# Altium schematic sheet Latching.SchDoc
size A3
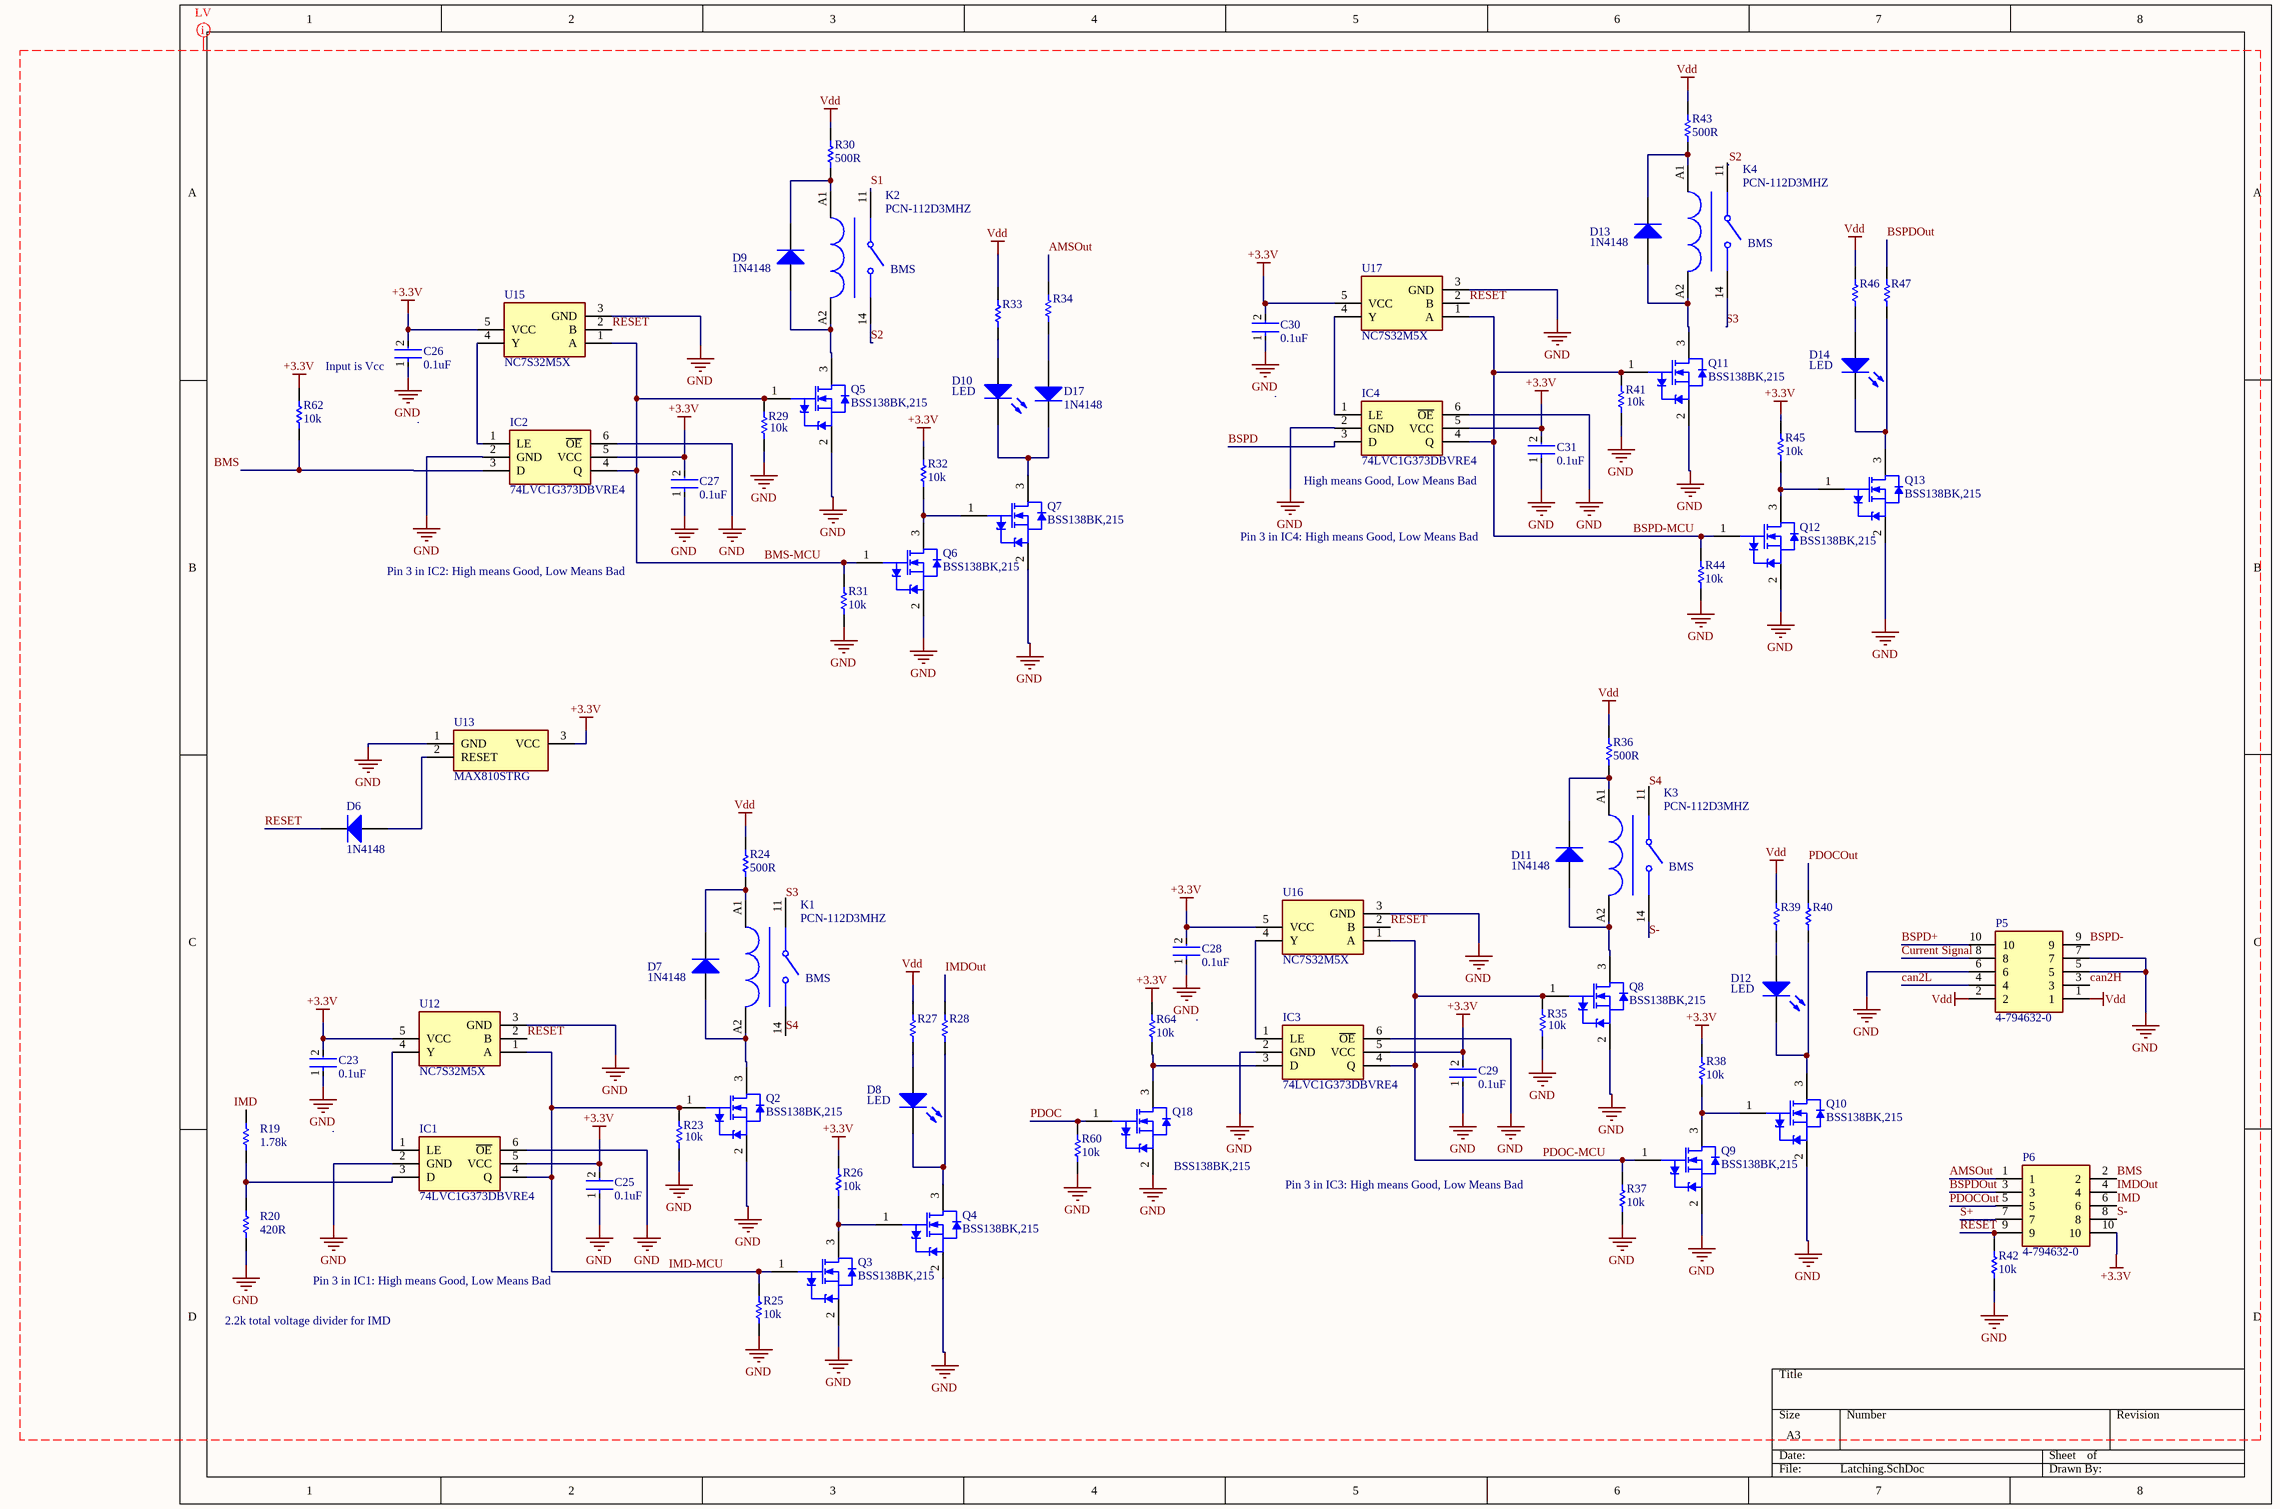
[diagram p0: Latching.SchDoc]

## Parts
C23  0.1uF  [FP-C0603-CJ-MFG]
C25  0.1uF  [FP-C0603-CJ-MFG]
C26  0.1uF  [FP-C0603-CJ-MFG]
C27  0.1uF  [FP-C0603-CJ-MFG]
C28  0.1uF  [FP-C0603-CJ-MFG]
C29  0.1uF  [FP-C0603-CJ-MFG]
C30  0.1uF  [FP-C0603-CJ-MFG]
C31  0.1uF  [FP-C0603-CJ-MFG]
D6  1N4148  [DIOD-SOD123-2_V]
D7  1N4148  [DIOD-SOD123-2_V]
D8  LED  [1206_A]
D9  1N4148  [DIOD-SOD123-2_V]
D10  LED  [1206_A]
D11  1N4148  [DIOD-SOD123-2_V]
D12  LED  [1206_A]
D13  1N4148  [DIOD-SOD123-2_V]
D14  LED  [1206_A]
D17  1N4148  [DIOD-SOD123-2_V]
IC1  74LVC1G373DBVRE4  [SOT95P280X145-6N]
IC2  74LVC1G373DBVRE4  [SOT95P280X145-6N]
IC3  74LVC1G373DBVRE4  [SOT95P280X145-6N]
IC4  74LVC1G373DBVRE4  [SOT95P280X145-6N]
K1  PCN-112D3MHZ  [PCN-112D3MHZ]
K2  PCN-112D3MHZ  [PCN-112D3MHZ]
K3  PCN-112D3MHZ  [PCN-112D3MHZ]
K4  PCN-112D3MHZ  [PCN-112D3MHZ]
P5  4-794632-0  [SHDR10W82P300_2X5_1586X686X944P]
P6  4-794632-0  [SHDR10W82P300_2X5_1586X686X944P]
Q2  BSS138BK,215  [NXP-SOT23_N]
Q3  BSS138BK,215  [NXP-SOT23_N]
Q4  BSS138BK,215  [NXP-SOT23_N]
Q5  BSS138BK,215  [NXP-SOT23_N]
Q6  BSS138BK,215  [NXP-SOT23_N]
Q7  BSS138BK,215  [NXP-SOT23_N]
Q8  BSS138BK,215  [NXP-SOT23_N]
Q9  BSS138BK,215  [NXP-SOT23_N]
Q10  BSS138BK,215  [NXP-SOT23_N]
Q11  BSS138BK,215  [NXP-SOT23_N]
Q12  BSS138BK,215  [NXP-SOT23_N]
Q13  BSS138BK,215  [NXP-SOT23_N]
Q18  BSS138BK,215  [NXP-SOT23_N]
R19  value 1.78k  [RESC1608X55N]  (hidden comment: Res1)
R20  value 420R  [RESC1608X55N]  (hidden comment: Res1)
R23  10k  [RESC1608X55N]
R24  500R  [RESC1608X55N]
R25  10k  [RESC1608X55N]
R26  10k  [RESC1608X55N]
R27  CRCW2512649RFKEG  [Resistor__E2512]  (value not drawn)
R28  CRCW2512649RFKEG  [Resistor__E2512]  (value not drawn)
R29  10k  [RESC1608X55N]
R30  500R  [RESC1608X55N]
R31  10k  [RESC1608X55N]
R32  10k  [RESC1608X55N]
R33  CRCW2512649RFKEG  [Resistor__E2512]  (value not drawn)
R34  CRCW2512649RFKEG  [Resistor__E2512]  (value not drawn)
R35  10k  [RESC1608X55N]
R36  500R  [RESC1608X55N]
R37  10k  [RESC1608X55N]
R38  10k  [RESC1608X55N]
R39  CRCW2512649RFKEG  [Resistor__E2512]  (value not drawn)
R40  CRCW2512649RFKEG  [Resistor__E2512]  (value not drawn)
R41  10k  [RESC1608X55N]
R42  10k  [RESC1608X55N]
R43  500R  [RESC1608X55N]
R44  10k  [RESC1608X55N]
R45  10k  [RESC1608X55N]
R46  CRCW2512649RFKEG  [Resistor__E2512]  (value not drawn)
R47  CRCW2512649RFKEG  [Resistor__E2512]  (value not drawn)
R60  10k  [RESC1608X55N]
R62  10k  [RESC1608X55N]
R64  10k  [RESC1608X55N]
U12  NC7S32M5X  [SOT95P275X110-5N]
U13  MAX810STRG  [SOT96P237X111-3N]
U15  NC7S32M5X  [SOT95P275X110-5N]
U16  NC7S32M5X  [SOT95P275X110-5N]
U17  NC7S32M5X  [SOT95P275X110-5N]

## Nets
+3.3V: C23.2 C25.2 C26.2 C27.2 C28.2 C29.2 C30.2 C31.2 IC1.5(VCC) IC2.5(VCC) IC3.5(VCC) IC4.5(VCC) P6.10 R26.2 R32.2 R38.2 R45.2 R62.2 R64.2 U12.5(VCC) U13.3(VCC) U15.5(VCC) U16.5(VCC) U17.5(VCC)
GND: C23.1 C25.1 C26.1 C27.1 C28.1 C29.1 C30.1 C31.1 IC1.2(GND) IC1.6(~{OE}) IC2.2(GND) IC2.6(~{OE}) IC3.2(GND) IC3.6(~{OE}) IC4.2(GND) IC4.6(~{OE}) P5.5 P5.6 P5.7 Q2.2(S) Q3.2(S) Q4.2(S) Q5.2(S) Q6.2(S) Q7.2(S) Q8.2(S) Q9.2(S) Q10.2(S) Q11.2(S) Q12.2(S) Q13.2(S) Q18.2(S) R20.1 R23.1 R25.1 R29.1 R31.1 R35.1 R37.1 R41.1 R42.1 R44.1 R60.1 U12.3(GND) U13.1(GND) U15.3(GND) U16.3(GND) U17.3(GND)
Vdd: P5.1 P5.2 R24.2 R27.2 R30.2 R33.2 R36.2 R39.2 R43.2 R46.2
AMSOut: P6.1 R34.2
BMS: IC2.3(D) P6.2 R62.1
BMS-MCU: IC2.4(Q) Q5.1(G) Q6.1(G) R29.2 R31.2 U15.1(A)
BSPD: IC4.3(D)
BSPD+: P5.10
BSPD-: P5.9
BSPD-MCU: IC4.4(Q) Q11.1(G) Q12.1(G) R41.2 R44.2 U17.1(A)
BSPDOut: P6.3 R47.2
can2H: P5.3
can2L: P5.4
Current Signal: P5.8
IMD: P6.6 R19.2
IMD-MCU: IC1.4(Q) Q2.1(G) Q3.1(G) R23.2 R25.2 U12.1(A)
IMDOut: P6.4 R28.2
PDOC: Q18.1(G) R60.2
PDOC-MCU: IC3.4(Q) Q8.1(G) Q9.1(G) R35.2 R37.2 U16.1(A)
PDOCOut: P6.5 R40.2
RESET: D6.2(K) P6.9 R42.2 U12.2(B) U15.2(B) U16.2(B) U17.2(B)
S1: K2.11
S2: K2.14 K4.11
S3: K1.11 K4.14
S4: K1.14 K3.11
S+: P6.7
S-: K3.14 P6.8
NetD6_1: D6.1(A) U13.2(RESET)
NetD7_1: D7.1(A) K1.A2 Q2.3(D)
NetD7_2: D7.2(K) K1.A1 R24.1
NetD8_1: D8.1(K) Q4.3(D) R28.1
NetD8_2: D8.2(A) R27.1
NetD9_1: D9.1(A) K2.A2 Q5.3(D)
NetD9_2: D9.2(K) K2.A1 R30.1
NetD10_1: D10.1(K) D17.2(K) Q7.3(D)
NetD10_2: D10.2(A) R33.1
NetD11_1: D11.1(A) K3.A2 Q8.3(D)
NetD11_2: D11.2(K) K3.A1 R36.1
NetD12_1: D12.1(K) Q10.3(D) R40.1
NetD12_2: D12.2(A) R39.1
NetD13_1: D13.1(A) K4.A2 Q11.3(D)
NetD13_2: D13.2(K) K4.A1 R43.1
NetD14_1: D14.1(K) Q13.3(D) R47.1
NetD14_2: D14.2(A) R46.1
NetD17_1: D17.1(A) R34.1
NetIC1_1: IC1.1(LE) U12.4(Y)
NetIC1_3: IC1.3(D) R19.1 R20.2
NetIC2_1: IC2.1(LE) U15.4(Y)
NetIC3_1: IC3.1(LE) U16.4(Y)
NetIC3_3: IC3.3(D) Q18.3(D) R64.1
NetIC4_1: IC4.1(LE) U17.4(Y)
NetQ3_3: Q3.3(D) Q4.1(G) R26.1
NetQ6_3: Q6.3(D) Q7.1(G) R32.1
NetQ9_3: Q9.3(D) Q10.1(G) R38.1
NetQ12_3: Q12.3(D) Q13.1(G) R45.1

## Layout directives
net class LV: +3.3V, AMSOut, BMS, BMS-MCU, BSPD, BSPD+, BSPD-, BSPD-MCU, BSPDOut, can2H, can2L, Current Signal, GND, IMD, IMD-MCU, IMDOut, PDOC, PDOC-MCU, PDOCOut, RESET, S1, S2, S3, S4, S+, S-, Vdd

## Notes on the sheet
- (near K4) BMS
- (near K2) BMS
- (near C26) Input is Vcc
- (near IC4) High means Good, Low Means Bad
- Pin 3 in IC2: High means Good, Low Means Bad
- Pin 3 in IC4: High means Good, Low Means Bad
- (near K3) BMS
- (near K1) BMS
- Pin 3 in IC3: High means Good, Low Means Bad
- 2.2k total voltage divider for IMD
- Pin 3 in IC1: High means Good, Low Means Bad

## Library data of the parts
C23 C25-C31 = CMP-2006-03300-2: CAP CER 0.1UF 50V X7R 0603; Manufacturer Part Number: C0603X104K5RACTU; Manufacturer: Kemet; Capacitance: 100nF; Material: Ceramic; Tolerance: 10%; Value: 100nF; Temperature Coefficient: 15%; Temperature Range High: +125°C; Temperature Range Low: -55°C; Voltage: 50V; ComponentLink2Description: Datasheet; RoHS: TRUE; ComponentLink2URL: https://content.kemet.com/datasheets/KEM_C1013_X7R_FT-CAP_SMD.pdf; Device Class L3: Ceramic Capacitors; Device Class L2: Capacitors; Package: C0603-CJ; Height: 0.95mm; Device Class L1: Passive Components; Temperature Characteristic: X7R; Lead Free: Yes; Digikey Description: CAP CER 0.1UF 50V X7R 0603; Automotive: No; Mouser Description: Capacitor; Ceramic; Cap 0.1uF; Tol+10%; SMT; Flexible Termination; Vol-Rtg 50V; TR; Temperature: -55°C to +125°C; Octopart: https://octopart.com/c0603x104k5ractu-kemet-9145062; Category: Cap; Voltage Rating: 50V; Ipc Land Pattern Name: CAPC16080X80
D6 D7 D9 D11 D13 D17 = 1N4148W-7-F: DIODE GEN PURP 100V 300MA SOD123; Manufacturer 1: Diodes; Forward Current: 150mA; Element Configuration: Single; Reverse Recovery Time: 4ns; Max Forward Surge Current (Ifsm): 2A; Polarity: Standard; Voltage Rating (DC): 75V; Power Rating: 400mW; Capacitance: 2pF; Peak Reverse Current: 1uA; Forward Voltage: 1.25V; Supplier 1: Digi-Key; Supplier Part Number 1: 1N4148W-FDIDKR-ND; Manufacturer Part Number 1: 1N4148W-7-F; Stock 1: 3523690; Pricing 1: 1=0.16000, 10=0.14600, 25=0.13880, 100=0.06110, 250=0.05868, 500=0.04800, 1000=0.03333 (USD); RoHS: Yes; Mount: Surface Mount; Number of Pins: 2; Weight: 0.000353oz; Contact Plating: Tin,Matte; Min Operating Temperature: -65°C; Max Operating Temperature: 150°C; Voltage: 100V; Packaging: Tape and Reel; Max Repetitive Reverse Voltage (Vrrm): 100V; Peak Non-Repetitive Surge Current: 2A; Current Rating: 150mA; Output Current: 150mA; Max Surge Current: 2A; Package Quantity: 3000; Recovery Time: 4ns; Max Reverse Voltage (DC): 100V; Average Rectified Current: 300mA; Power Dissipation: 400mW; Length: 2.85mm; Height: 1.25mm; Width: 1.7mm; Radiation Hardening: No; REACH SVHC: No SVHC; Lead Free: Lead Free; ComponentLink1URL: https://datasheet.ciiva.com/911/ds30086-911734.pdf?src-supplier=Digi-Key; ComponentLink1Description: https://datasheet.ciiva.com/911/ds30086-911734.pdf?src-supplier=Digi-Key; ComponentLink2URL: https://datasheet.ciiva.com/911/ds30086-911735.pdf?src-supplier=Digi-Key; ComponentLink2Description: https://datasheet.ciiva.com/911/ds30086-911735.pdf?src-supplier=Digi-Key; ComponentLink3URL: https://datasheet.ciiva.com/911/ds30086-911736.pdf?src-supplier=Digi-Key; ComponentLink3Description: https://datasheet.ciiva.com/911/ds30086-911736.pdf?src-supplier=Digi-Key; ComponentLink4URL: https://datasheet.ciiva.com/8300/ds30086-8300392.pdf?src-supplier=Avnet; ComponentLink4Description: https://datasheet.ciiva.com/8300/ds30086-8300392.pdf?src-supplier=Avnet; ComponentLink5URL: https://datasheet.ciiva.com/25919/ds30086-25919609.pdf?src-supplier=Avnet+Europe; ComponentLink5Description: https://datasheet.ciiva.com/25919/ds30086-25919609.pdf?src-supplier=Avnet+Europe; ComponentLink6URL: https://datasheet.ciiva.com/22695/1915529-22695239.pdf?src-supplier=Element14; ComponentLink6Description: https://datasheet.ciiva.com/22695/1915529-22695239.pdf?src-supplier=Element14; ComponentLink7URL: https://datasheet.ciiva.com/1179/1915529-1179304.pdf?src-supplier=Element14; ComponentLink7Description: https://datasheet.ciiva.com/1179/1915529-1179304.pdf?src-supplier=Element14; ComponentLink8URL: https://datasheet.ciiva.com/4435/ds30086-4435128.pdf?src-supplier=Mouser; ComponentLink8Description: https://datasheet.ciiva.com/4435/ds30086-4435128.pdf?src-supplier=Mouser; ComponentLink9URL: https://datasheet.ciiva.com/15219/getdatasheetpartid-110030-15219548.pdf?src-supplier=Verical; ComponentLink9Description: https://datasheet.ciiva.com/15219/getdatasheetpartid-110030-15219548.pdf?src-supplier=Verical; ComponentLink10URL: https://datasheet.ciiva.com/8303/ds30086-8303197.pdf?src-supplier=Avnet; ComponentLink10Description: https://datasheet.ciiva.com/8303/ds30086-8303197.pdf?src-supplier=Avnet
D8 D10 D12 D14 = 150120SS75000: WURTH ELEKTRONIK   150120SS75000   LED, 1206, SUP. RED, 60MCD, 630NM; Manufacturer 1: Wurth Electronics; Test Current: 20mA; Viewing Angle: 140°; Lens Style: Clear,Rectangular; Forward Current: 30mA; Forward Voltage: 1.9V; Supplier 1: Digi-Key; Supplier Part Number 1: 732-4992-1-ND; Manufacturer Part Number 1: 150120SS75000; Stock 1: 2344; Pricing 1: 1=0.21000, 50=0.19800, 100=0.17100, 500=0.14800 (USD); RoHS: Yes; Mount: Surface Mount; Case/Package: 1206; Color: Red; Case Code (Metric): 3216; Case Code (Imperial): 1206; Min Operating Temperature: -40°C; Max Operating Temperature: 85°C; Dominant Wavelength: 630nm; Package Quantity: 3000; Packaging: Tape and Reel; Luminous Intensity: 60mcd; Wavelength: 630nm; Length: 3.2mm; Height: 0.68mm; Width: 1.6mm; REACH SVHC: Unknown; ComponentLink1URL: https://datasheet.ciiva.com/29561/150120ss75000-29561862.pdf?src-supplier=Digi-Key; ComponentLink1Description: https://datasheet.ciiva.com/29561/150120ss75000-29561862.pdf?src-supplier=Digi-Key; ComponentLink2URL: https://datasheet.ciiva.com/29279/759443-da-01-en-chipled-1206-w-kl-s-rot-150120ss75000-29279053.pdf?src-supplier=Conrad; ComponentLink2Description: https://datasheet.ciiva.com/29279/759443-da-01-en-chipled-1206-w-kl-s-rot-150120ss75000-29279053.pdf?src-supplier=Conrad; ComponentLink3URL: https://datasheet.ciiva.com/29561/150120ss75000-29561863.pdf?src-supplier=Digi-Key; ComponentLink3Description: https://datasheet.ciiva.com/29561/150120ss75000-29561863.pdf?src-supplier=Digi-Key; ComponentLink4URL: https://datasheet.ciiva.com/48430/150120ss75000-eng-tds-48430055.pdf?src-supplier=Distrelec; ComponentLink4Description: https://datasheet.ciiva.com/48430/150120ss75000-eng-tds-48430055.pdf?src-supplier=Distrelec; ComponentLink5URL: https://datasheet.ciiva.com/29561/150120ss75000-29561864.pdf?src-supplier=Digi-Key; ComponentLink5Description: https://datasheet.ciiva.com/29561/150120ss75000-29561864.pdf?src-supplier=Digi-Key
IC1-IC4 = 74LVC1G373DBVRE4: Integrated Circuit; Manufacturer_Name: Texas Instruments; Datasheet Link: http://www.ti.com/general/docs/suppproductinfo.tsp?distId=10&gotoUrl=http%3A%2F%2Fwww.ti.com%2Flit%2Fgpn%2Fsn74lvc1g373; Height: 1.45mm; Manufacturer_Part_Number: 74LVC1G373DBVRE4
K1-K4 = PCN-112D3MHZ: Relay
P5 P6 = 4-794632-0: Connector; Manufacturer_Name: TE Connectivity; Datasheet Link: https://www.mouser.com/ProductDetail/TE-Connectivity-AMP/4-794632-0?qs=Rd%252BN518myCyGOpGRvqIhCg%3D%3D; Height: 9.44mm; Manufacturer_Part_Number: 4-794632-0; Mouser Part Number: 571-4-794632-0; Mouser Price/Stock: https://www.mouser.co.uk/ProductDetail/TE-Connectivity-AMP/4-794632-0?qs=Rd%252BN518myCyGOpGRvqIhCg%3D%3D
Q2-Q13 Q18 = CMP-1259-00087-1: N-Channel Trench MOSFET, 60 V, 0.36 A, -55 to 150 degC, 3-Pin SOT23, Tape and Reel; Manufacturer: NXP Semiconductors; Channel Type: N; IDM [max] (A): 1.2; VDS [max] (V): 60; Packing: Tape & Reel; ID [max] (A): 0.36; Automotive Qualified: Y; VGSth [typ] (V): 1.1; PackageReference: SOT23; Code_JEDEC: TO-236AB; PackageDescription: 3-Pin Small Outline Transistor Package, Body 2.9 x 1.3 mm, Pitch 0.95 mm; ComponentLink2URL: http://www.nxp.com/documents/data_sheet/BSS138BK.pdf; PartNumber: BSS138BK,215; DatasheetVersion: Rev. 1; ComponentLink3Description: Package Specification; ComponentLink3URL: http://www.nxp.com/documents/outline_drawing/sot023_po.pdf; Mounting Technology: Surface Mount; ComponentLink1URL: http://www.nxp.com/; ComponentLink1Description: Manufacturer URL; ComponentLink2Description: Datasheet; PackageVersion: 06-03-16, 03/2006
R19 R20 = Res1: 679-0260; Published: 8-Jun-2000; LatestRevisionDate: 17-Jul-2002; LatestRevisionNote: Re-released for DXP Platform.; PackageReference: AXIAL-0.3; Publisher: Altium Limited; PackageDescription: Axial Device, Thru-Hole; 2 Leads; 0.3 in Pin Spacing
R23-R26 R29-R32 R35-R38 R41-R45 R60 R62 R64 = RC0805JR-0710KL: 10k E0805 1% 1/8W; Tolerance: 5%; Resistance: 10kR; Power Rating: 125mW; Temperature Coefficient: 100ppm/°C; Voltage Rating: 150V; MPN: *; Category: *; RoHS: Yes; Case/Package: 0805; Contact Plating: Tin; Case Code (Imperial): 0805; Case Code (Metric): 2012; Min Operating Temperature: -55°C; Max Operating Temperature: 155°C; Composition: Thick Film; Packaging: Tape and Reel; Termination: SMD/SMT; Military Standard: Not; Length: 2mm; Height: 0.5mm; Width: 1.25mm; Depth: 1.25mm; Radiation Hardening: No; REACH SVHC: Unknown; Lead Free: Lead Free; ComponentLink1URL: https://datasheet.ciiva.com/7941/444164-7941870.pdf?src-supplier=Element14; ComponentLink1Description: https://datasheet.ciiva.com/7941/444164-7941870.pdf?src-supplier=Element14; ComponentLink2URL: https://datasheet.ciiva.com/7941/444164-7941871.pdf?src-supplier=Element14; ComponentLink2Description: https://datasheet.ciiva.com/7941/444164-7941871.pdf?src-supplier=Element14; ComponentLink3URL: https://datasheet.ciiva.com/7983/444164-7983765.pdf?src-supplier=Element14; ComponentLink3Description: https://datasheet.ciiva.com/7983/444164-7983765.pdf?src-supplier=Element14; Supplier 1: Digi-Key; Supplier Part Number 1: 311-10KARCT-ND
R27 R28 R33 R34 R39 R40 R46 R47 = CRCW2512649RFKEG: RES SMD 649 OHM 1% 1W 2512; Manufacturer 1: Vishay Dale; Resistance: 649R; Temperature Coefficient: 100ppm/°C; Voltage Rating (DC): 500V; Supplier 1: Digi-Key; Supplier Part Number 1: 541-649AFCT-ND; Manufacturer Part Number 1: CRCW2512649RFKEG; Stock 1: 2166; Pricing 1: 1=0.38000, 10=0.31800, 100=0.12420, 1000=0.05198 (USD); RoHS: Yes; Case/Package: 2512; Case Code (Metric): 6432; Case Code (Imperial): 2512; Min Operating Temperature: -55°C; Max Operating Temperature: 155°C; Package Quantity: 10; Tolerance: 1%; Packaging: Tape and Reel; Composition: Thick Film; Number of Terminations: 2; Features: Automotive AEC-Q200; Max Power Dissipation: 1W; Length: 0.248inch; Height: 0.028inch; Width: 0.124inch; Lead Free: Lead Free; ComponentLink1URL: https://datasheet.ciiva.com/2479/dcrcwe3-2479296.pdf?src-supplier=Digi-Key; ComponentLink1Description: https://datasheet.ciiva.com/2479/dcrcwe3-2479296.pdf?src-supplier=Digi-Key; ComponentLink2URL: https://datasheet.ciiva.com/2479/dcrcwe3-2479297.pdf?src-supplier=Digi-Key; ComponentLink2Description: https://datasheet.ciiva.com/2479/dcrcwe3-2479297.pdf?src-supplier=Digi-Key; ComponentLink3URL: https://datasheet.ciiva.com/2479/dcrcwe3-2479298.pdf?src-supplier=Digi-Key; ComponentLink3Description: https://datasheet.ciiva.com/2479/dcrcwe3-2479298.pdf?src-supplier=Digi-Key
U12 U15-U17 = NC7S32M5X: OR GATEEEE; Manufacturer_Name: ON Semiconductor; Datasheet Link: https://componentsearchengine.com/Datasheets/2/NC7S32M5X.pdf; Height: 1.1mm; Manufacturer_Part_Number: NC7S32M5X
U13 = MAX810TTRG: Integrated Circuit; Manufacturer_Name: ON Semiconductor; Datasheet Link: http://www.onsemi.com/pub/Collateral/MAX809S-D.PDF; Height: 1.11mm; Manufacturer_Part_Number: MAX810TTRG